# Altium schematic sheet EDVDU.SchDoc
size A0
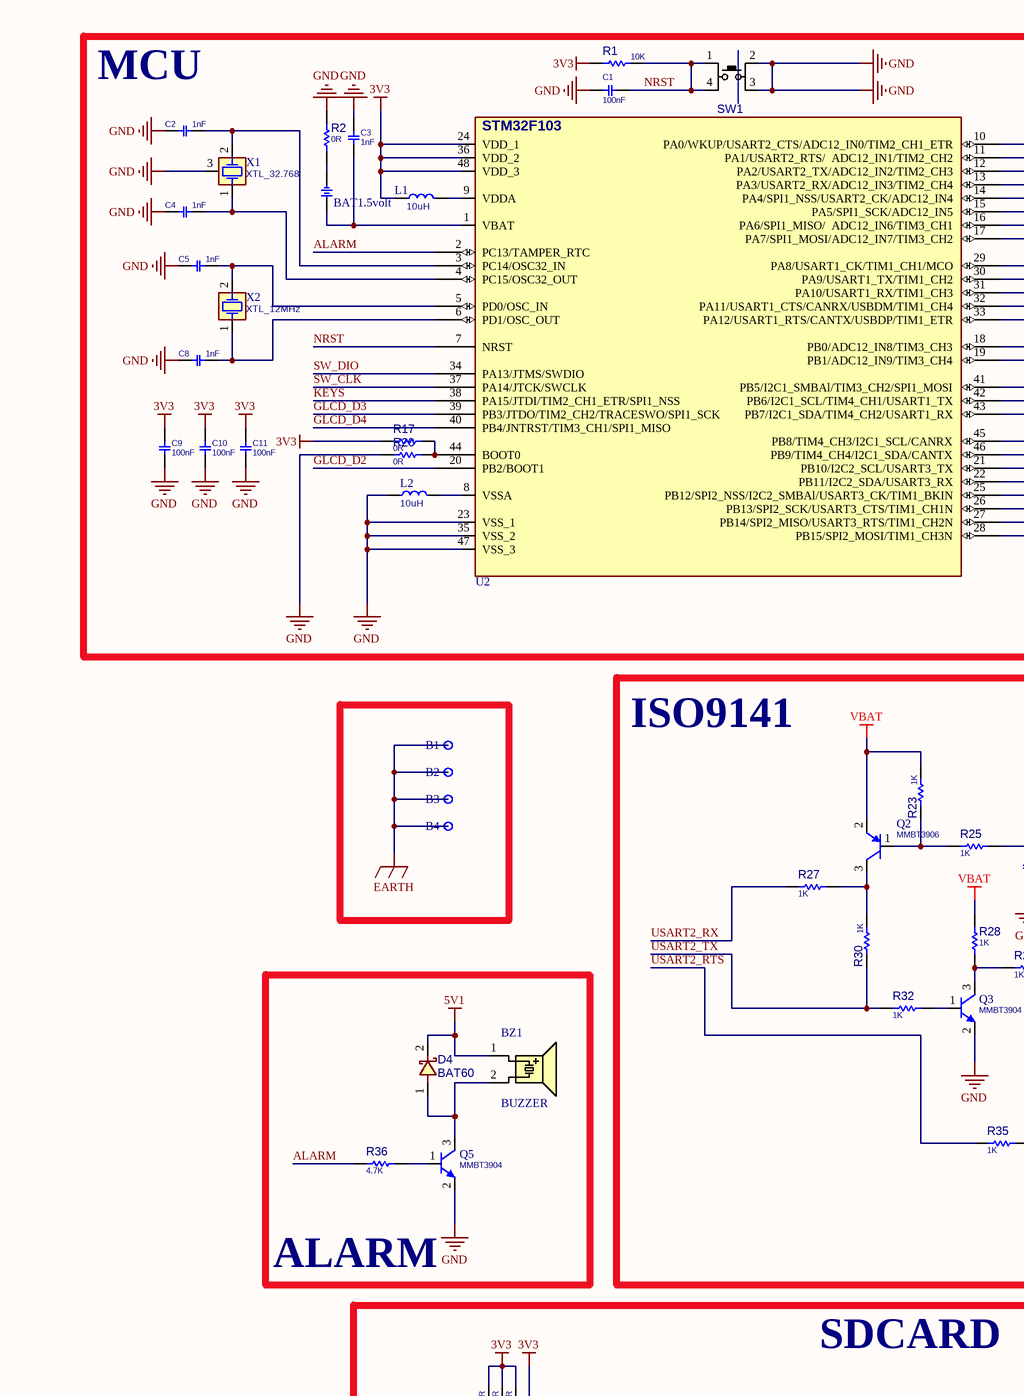
[diagram p0: EDVDU.SchDoc, top left]
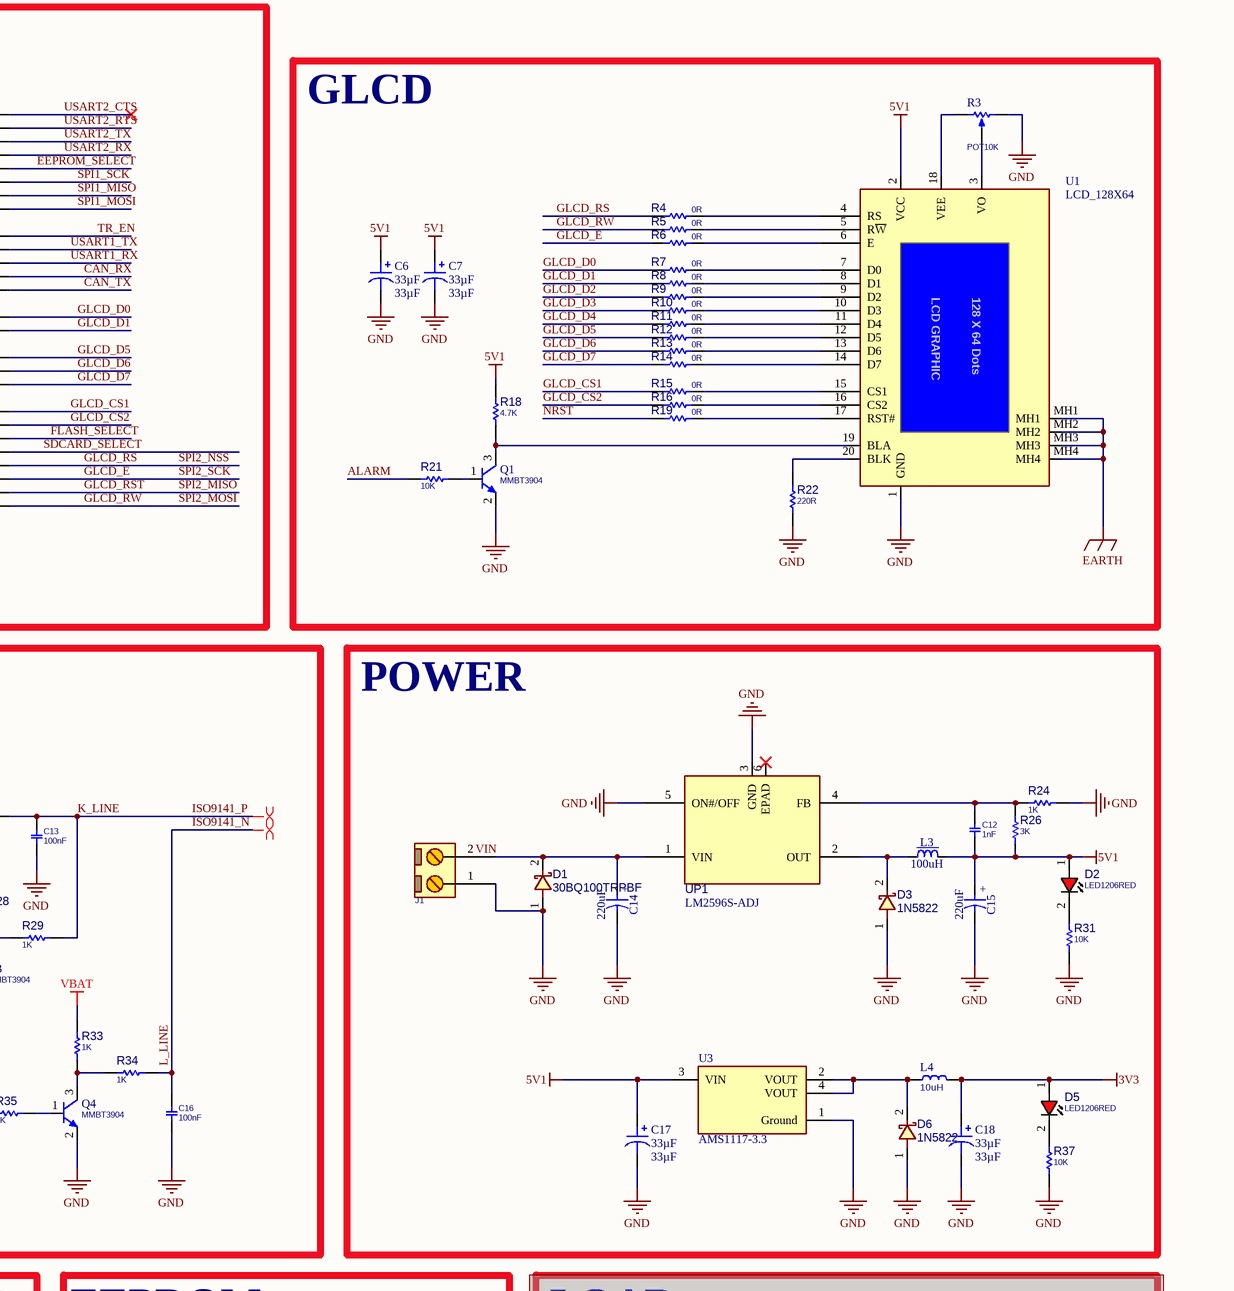
[diagram p1: EDVDU.SchDoc, top right]
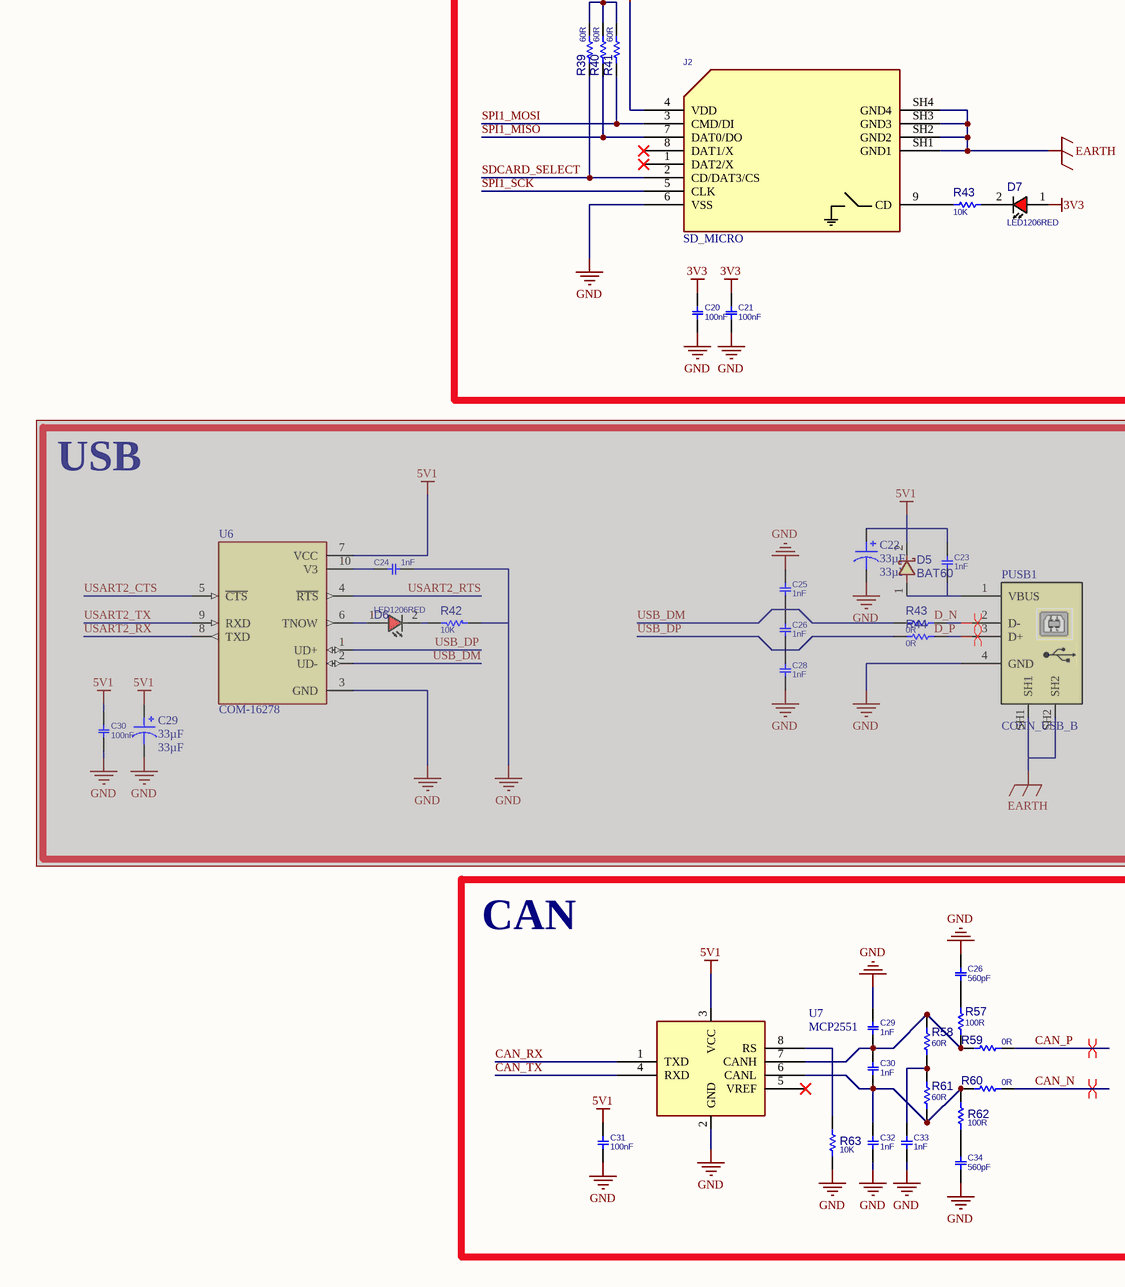
[diagram p2: EDVDU.SchDoc, bottom left]
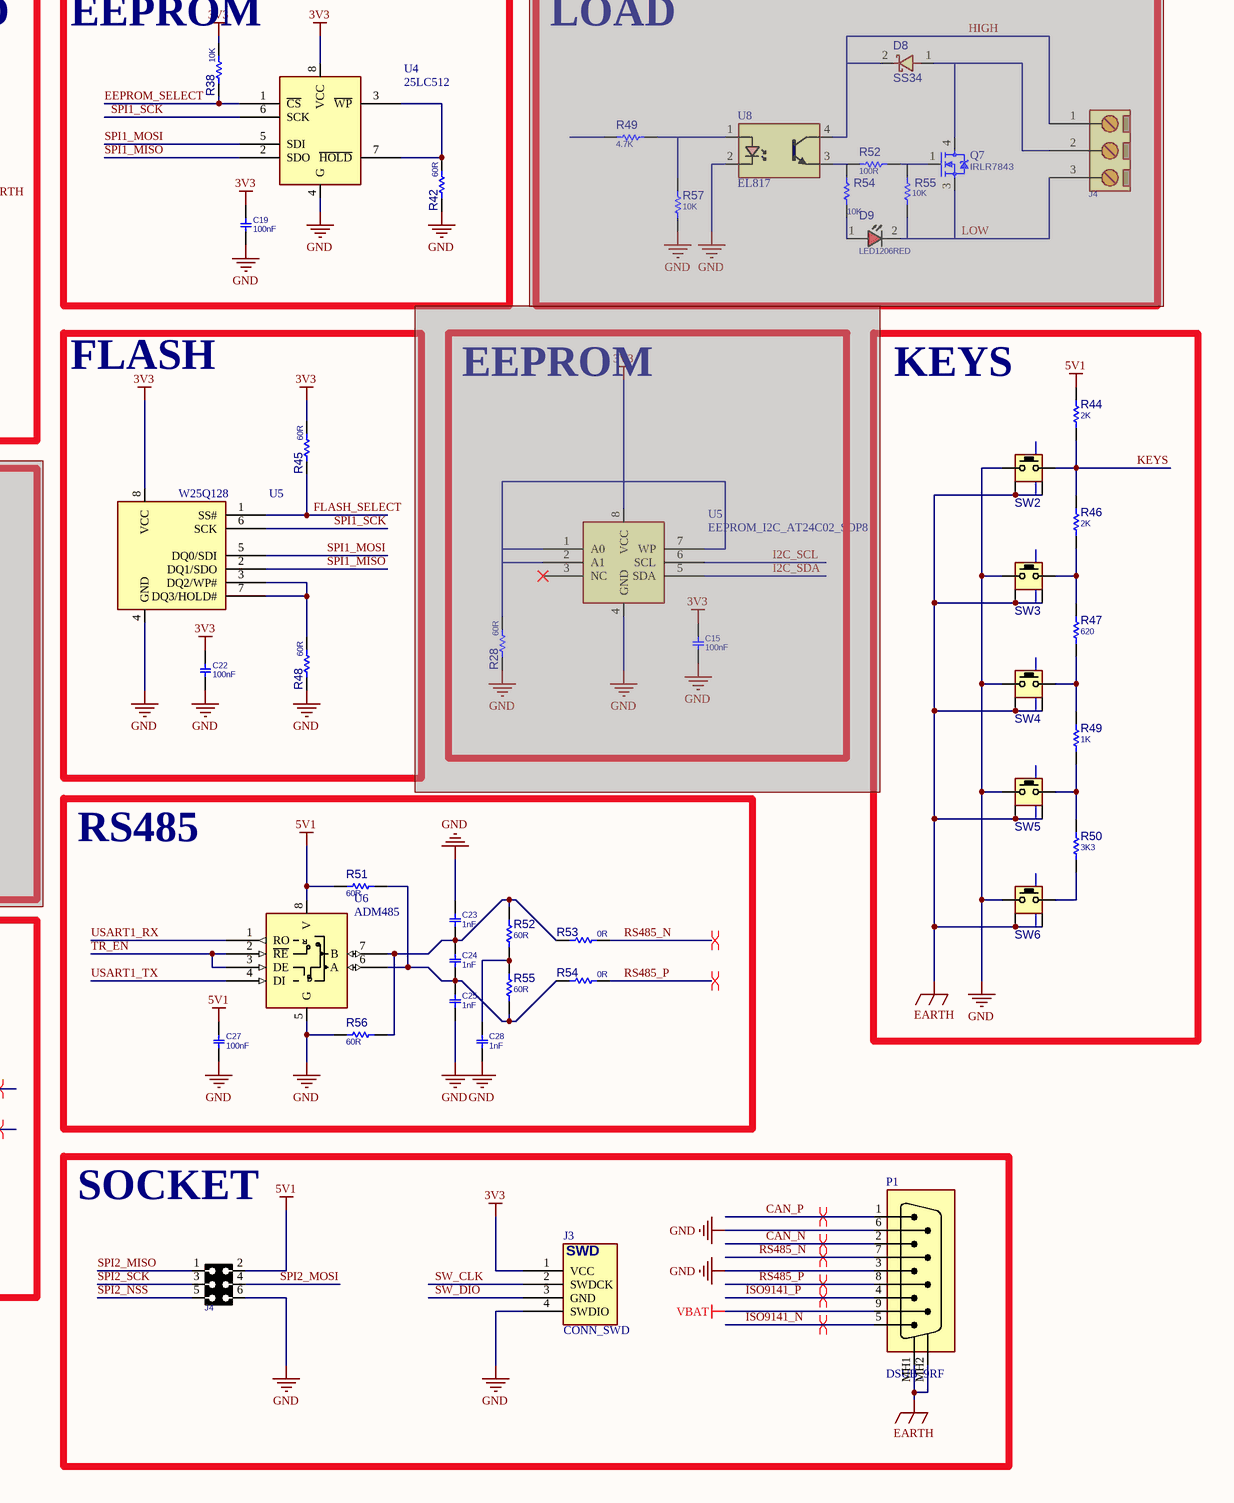
[diagram p3: EDVDU.SchDoc, bottom right]

## Parts
(Parts that share a designator on the sheet are numbered #1, #2 ... from top to bottom, then left to right.)
B1  Plated Hole  [MTG320_550]  (value not drawn)  (no BOM)
B2  Plated Hole  [MTG320_550]  (value not drawn)  (no BOM)
B3  Plated Hole  [MTG320_550]  (value not drawn)  (no BOM)
B4  Plated Hole  [MTG320_550]  (value not drawn)  (no BOM)
BT1  BAT1.5volt  [BT_TS518FE_FL35E]
BZ1  BUZZER  [BZ_C12]
C1  100nF  [C1206]
C2  1nF  [C1206]
C3  1nF  [C1206]
C4  1nF  [C1206]
C5  1nF  [C1206]
C6  33µF  [CAP POL 1206_3216]
C7  33µF  [CAP POL 1206_3216]
C8  1nF  [C1206]
C9  100nF  [C1206]
C10  100nF  [C1206]
C11  100nF  [C1206]
C12  1nF  [C1206]
C13  100nF  [C1206]
C14  220uF  [CAPMP7343X430N]
C15#1  220uF  [CAPMP7343X430N]
C15#2  100nF  [C1206]  (masked out: inside a compile mask, not in the netlist)
C16  100nF  [C1206]
C17  33µF  [CAP POL 1206_3216]
C18  33µF  [CAP POL 1206_3216]
C19  100nF  [C1206]
C20  100nF  [C1206]
C21  100nF  [C1206]
C22#1  33µF  [CAP POL 1206_3216]  (masked out: inside a compile mask, not in the netlist)
C22#2  100nF  [C1206]
C23#1  1nF  [C1206]  (masked out: inside a compile mask, not in the netlist)
C23#2  1nF  [C1206]
C24#1  1nF  [C1206]  (masked out: inside a compile mask, not in the netlist)
C24#2  1nF  [C1206]
C25#1  1nF  [C1206]  (masked out: inside a compile mask, not in the netlist)
C25#2  1nF  [C1206]
C26#1  1nF  [C1206]  (masked out: inside a compile mask, not in the netlist)
C26#2  560pF  [C1206]
C27  100nF  [C1206]
C28#1  1nF  [C1206]  (masked out: inside a compile mask, not in the netlist)
C28#2  1nF  [C1206]
C29#1  33µF  [CAP POL 1206_3216]  (masked out: inside a compile mask, not in the netlist)
C29#2  1nF  [C1206]
C30#1  100nF  [C1206]  (masked out: inside a compile mask, not in the netlist)
C30#2  1nF  [C1206]
C31  100nF  [C1206]
C32  1nF  [C1206]
C33  1nF  [C1206]
C34  560pF  [C1206]
D1  30BQ100TRPBF  [D_SMC]
D2  LED1206RED  [LED1206RED]
D3  1N5822  [D_SMA]
D4  BAT60  [D_SOD323F]
D5#1  LED1206RED  [LED1206RED]
D5#2  BAT60  [D_SOD323F]  (masked out: inside a compile mask, not in the netlist)
D6#1  1N5822  [D_SMA]
D6#2  LED1206RED  [LED1206RED]  (masked out: inside a compile mask, not in the netlist)
D7  LED1206RED  [LED1206RED]
D8  SS34  [D_SMB]  (masked out: inside a compile mask, not in the netlist)
D9  LED1206RED  [LED1206RED]  (masked out: inside a compile mask, not in the netlist)
J1  CONN_MSTB2  [MSTB_2]  (value not drawn)
J2  SD_MICRO  [SDMICRO_AT]
J3  CONN_SWD  [WF_4]
J4#1  CONN_MSTB3  [MSTB_3]  (value not drawn)  (masked out: inside a compile mask, not in the netlist)
J4#2  HDRF_2X3  [HDRR_F_2X3]  (value not drawn)
L1  10uH  [L1206]
L2  10uH  [L1206]
L3  100uH  [IND_WURTH_WE-PD_XXL]
L4  10uH  [L1206]
P1  DSUB_9RF  [DSUB_9RF]
PUSB1  CONN_USB_B  [USB_B_RA_THD]  (masked out: inside a compile mask, not in the netlist)
Q1  MMBT3904  [SOT23_3]
Q2  MMBT3906  [SOT23_3]
Q3  MMBT3904  [SOT23_3]
Q4  MMBT3904  [SOT23_3]
Q5  MMBT3904  [SOT23_3]
Q7  IRLR7843  [DPAK_3]  (masked out: inside a compile mask, not in the netlist)
R1  10K  [R0805]
R2  0R  [R0805]
R3  POT10K  [POTS_5MM]
R4  0R  [R0805]
R5  0R  [R0805]
R6  0R  [R0805]
R7  0R  [R0805]
R8  0R  [R0805]
R9  0R  [R0805]
R10  0R  [R0805]
R11  0R  [R0805]
R12  0R  [R0805]
R13  0R  [R0805]
R14  0R  [R0805]
R15  0R  [R0805]
R16  0R  [R0805]
R17  0R  [R0805]
R18  4.7K  [R0805]
R19  0R  [R0805]
R20  0R  [R0805]
R21  10K  [R0805]
R22  220R  [R0805]
R23  1K  [R0805]
R24  1K  [R1206]
R25  1K  [R0805]
R26  3K  [R1206]
R27  1K  [R0805]
R28#1  1K  [R0805]
R28#2  60R  [R0805]  (masked out: inside a compile mask, not in the netlist)
R29  1K  [R0805]
R30  1K  [R0805]
R31  10K  [R0805]
R32  1K  [R0805]
R33  1K  [R0805]
R34  1K  [R0805]
R35  1K  [R0805]
R36  4.7K  [R0805]
R37  10K  [R0805]
R38  10K  [R0805]
R39  60R  [R0805]
R40  60R  [R0805]
R41  60R  [R0805]
R42#1  60R  [R0805]
R42#2  10K  [R0805]  (masked out: inside a compile mask, not in the netlist)
R43#1  10K  [R0805]
R43#2  0R  [R0805]  (masked out: inside a compile mask, not in the netlist)
R44#1  2K  [R0805]
R44#2  0R  [R0805]  (masked out: inside a compile mask, not in the netlist)
R45  60R  [R0805]
R46  2K  [R0805]
R47  620  [R0805]
R48  60R  [R0805]
R49#1  4.7K  [R0805]  (masked out: inside a compile mask, not in the netlist)
R49#2  1K  [R0805]
R50  3K3  [R0805]
R51  60R  [R0805]
R52#1  100R  [R0805]  (masked out: inside a compile mask, not in the netlist)
R52#2  60R  [R0805]
R53  0R  [R0805]
R54#1  10K  [R0805]  (masked out: inside a compile mask, not in the netlist)
R54#2  0R  [R0805]
R55#1  10K  [R0805]  (masked out: inside a compile mask, not in the netlist)
R55#2  60R  [R0805]
R56  60R  [R0805]
R57#1  10K  [R0805]  (masked out: inside a compile mask, not in the netlist)
R57#2  100R  [R0805]
R58  60R  [R0805]
R59  0R  [R0805]
R60  0R  [R0805]
R61  60R  [R0805]
R62  100R  [R0805]
R63  10K  [R0805]
SW1  PUSHBUTTON  [SWPBS_SPDT_6X6X5]  (value not drawn)
SW2  PUSHBUTTON  [SWPBT_SPST_R_6X6X6]  (value not drawn)
SW3  PUSHBUTTON  [SWPBT_SPST_R_6X6X6]  (value not drawn)
SW4  PUSHBUTTON  [SWPBT_SPST_R_6X6X6]  (value not drawn)
SW5  PUSHBUTTON  [SWPBT_SPST_R_6X6X6]  (value not drawn)
SW6  PUSHBUTTON  [SWPBT_SPST_R_6X6X6]  (value not drawn)
U1  LCD_128X64  [LCDG_128X64_BLU]
U2  STM32F103  [QFG50_48]  (value not drawn)
U3  AMS1117-3.3  [FP-AMS1117-IPC_B]
U4  25LC512  [SO_8]
U5#1  W25Q128  [SO_8_W]
U5#2  EEPROM_I2C_AT24C02_SOP8  [SO_8]  (masked out: inside a compile mask, not in the netlist)
U6#1  COM-16278  [SOP50P490X120-10N]  (masked out: inside a compile mask, not in the netlist)
U6#2  ADM485  [SO_8]
U7  MCP2551  [SO_8]
U8  EL817  [DIP_4SMD]  (masked out: inside a compile mask, not in the netlist)
UP1  LM2596S-ADJ  [D2PAK_5]
X1  XTL_32.768  [XTL_RTC]
X2  XTL_12MHz  [XTL_2_11X5]

## Blocks framed on the sheet
MCU: BT1 C1-C5 C8-C11 L1 L2 R1 R2 R17 R20 SW1 U2 X1 X2
GLCD: C6 C7 Q1 R3-R16 R18 R19 R21 R22 U1
ISO9141: C13 C16 Q2-Q4 R23 R25 R27 R28#1 R29 R30 R32-R35
POWER: C12 C14 C15#1 C17 C18 D1-D3 D5#1 D6#1 J1 L3 L4 R24 R26 R31 R37 U3 UP1
ALARM: BZ1 D4 Q5 R36
SDCARD: C20 C21 D7 J2 R39-R41 R43#1
EEPROM: C19 R38 R42#1 U4
LOAD: D8 D9 J4#1 Q7 R49#1 R52#1 R54#1 R55#1 R57#1 U8
FLASH: C22#2 R45 R48 U5#1
EEPROM: C15#2 R28#2 U5#2
KEYS: R44#1 R46 R47 R49#2 R50 SW2-SW6
USB: C22#1 C23#1 C24#1 C25#1 C26#1 C28#1 C29#1 C30#1 D5#2 D6#2 PUSB1 R42#2 R43#2 R44#2 U6#1
RS485: C23#2 C24#2 C25#2 C27 C28#2 R51 R52#2 R53 R54#2 R55#2 R56 U6#2
CAN: C26#2 C29#2 C30#2 C31-C34 R57#2 R58-R63 U7
SOCKET: J3 J4#2 P1

## Nets
3V3: C9.2 C10.2 C11.2 C18.1 C19.2 C20.2 C21.2 C22#2.2 D5#1.1(ANODE) D7.1(ANODE) J2.4(VDD) J3.1(VCC) L1.1 L4.2 R1.2 R17.2 R38.1 R39.1 R40.1 R41.1 R45.1 U2.24(VDD_1) U2.36(VDD_2) U2.48(VDD_3) U4.8(VCC) U5#1.8(VCC)
5V1: BZ1.1(A) C6.1 C7.1 C12.1 C15#1.1 C17.1 C27.2 C31.2 D2.1(ANODE) D4.2 J4#2.2 L3.2 R18.1 R26.1 R44#1.2 R51.2 U1.2(VCC) U3.3(VIN) U6#2.8(V) U7.3(VCC)
EARTH: B1.1 B2.1 B3.1 B4.1 J2.SH1(GND1) J2.SH2(GND2) J2.SH3(GND3) J2.SH4(GND4) P1.MH1 P1.MH2 SW2.MH1 SW2.MH2 SW3.MH1 SW3.MH2 SW4.MH1 SW4.MH2 SW5.MH1 SW5.MH2 SW6.MH1 SW6.MH2 U1.MH1 U1.MH2 U1.MH3 U1.MH4
GND: C1.1 C2.2 C3.2 C4.2 C5.2 C6.2 C7.2 C8.2 C9.1 C10.1 C11.1 C13.1 C14.2 C15#1.2 C16.1 C17.2 C18.2 C19.1 C20.1 C21.1 C22#2.1 C23#2.1 C25#2.2 C26#2.2 C27.1 C28#2.2 C29#2.1 C31.1 C32.2 C33.2 C34.2 D1.1 D3.1 D6#1.1 J1.1 J2.6(VSS) J3.4(SWDIO) J4#2.6 L2.1 P1.3 P1.6 Q1.2(E) Q3.2(E) Q4.2(E) Q5.2(E) R2.2 R3.3(BOT) R20.2 R22.1 R24.1 R31.1 R37.1 R42#1.2 R48.2 R56.2 R63.1 SW1.2(P3) SW1.3(P4) SW2.1 SW3.1 SW4.1 SW5.1 SW6.1 U1.1(GND) U2.23(VSS_1) U2.35(VSS_2) U2.47(VSS_3) U3.1(Ground) U4.4(G) U5#1.4(GND) U6#2.5(G) U7.2(GND) UP1.3(GND) UP1.5(ON#/OFF) X1.3(CASE)
VBAT: P1.9 Q2.2(E) R23.1 R28#1.1 R33.1
ALARM: R21.1 R36.2 U2.2(PC13/TAMPER_RTC)
CAN_N: P1.2 R60.2
CAN_P: P1.1 R59.2
CAN_RX: U2.32(PA11/USART1_CTS/CANRX/USBDM/TIM1_CH4) U7.1(TXD)
CAN_TX: U2.33(PA12/USART1_RTS/CANTX/USBDP/TIM1_ETR) U7.4(RXD)
EEPROM_SELECT: R38.2 U2.14(PA4/SPI1_NSS/USART2_CK/ADC12_IN4) U4.1(~{CS})
FLASH_SELECT: R45.2 U2.21(PB10/I2C2_SCL/USART3_TX) U5#1.1(SS#)
GLCD_CS1: R15.1 U2.45(PB8/TIM4_CH3/I2C1_SCL/CANRX)
GLCD_CS2: R16.1 U2.46(PB9/TIM4_CH4/I2C1_SDA/CANTX)
GLCD_D0: R7.1 U2.18(PB0/ADC12_IN8/TIM3_CH3)
GLCD_D1: R8.1 U2.19(PB1/ADC12_IN9/TIM3_CH4)
GLCD_D2: R9.1 U2.20(PB2/BOOT1)
GLCD_D3: R10.1 U2.39(PB3/JTDO/TIM2_CH2/TRACESWO/SPI1_SCK)
GLCD_D4: R11.1 U2.40(PB4/JNTRST/TIM3_CH1/SPI1_MISO)
GLCD_D5: R12.1 U2.41(PB5/I2C1_SMBAl/TIM3_CH2/SPI1_MOSI)
GLCD_D6: R13.1 U2.42(PB6/I2C1_SCL/TIM4_CH1/USART1_TX)
GLCD_D7: R14.1 U2.43(PB7/I2C1_SDA/TIM4_CH2/USART1_RX)
GLCD_E: J4#2.3 R6.1 U2.26(PB13/SPI2_SCK/USART3_CTS/TIM1_CH1N)  [also labelled SPI2_SCK]
GLCD_RS: J4#2.5 R4.1 U2.25(PB12/SPI2_NSS/I2C2_SMBAl/USART3_CK/TIM1_BKIN)  [also labelled SPI2_NSS]
GLCD_RST: J4#2.1 U2.27(PB14/SPI2_MISO/USART3_RTS/TIM1_CH2N)  [also labelled SPI2_MISO]
GLCD_RW: J4#2.4 R5.1 U2.28(PB15/SPI2_MOSI/TIM1_CH3N)  [also labelled SPI2_MOSI]
ISO9141_N: C16.2 P1.5 R34.1  [also labelled L_LINE]
ISO9141_P: C13.2 P1.4 R25.1 R29.1  [also labelled K_LINE]
KEYS: R44#1.1 R46.2 SW2.2 U2.38(PA15/JTDI/TIM2_CH1_ETR/SPI1_NSS)
NRST: C1.2 R1.1 R19.1 SW1.1(P1) SW1.4(P2) U2.7(NRST)
RS485_N: P1.7 R53.2
RS485_P: P1.8 R54#2.2
SDCARD_SELECT: J2.2(CD/DAT3/CS) R39.2 U2.22(PB11/I2C2_SDA/USART3_RX)
SPI1_MISO: J2.7(DAT0/DO) R40.2 U2.16(PA6/SPI1_MISO/__ADC12_IN6/TIM3_CH1) U4.2(SDO) U5#1.2(DQ1/SDO)
SPI1_MOSI: J2.3(CMD/DI) R41.2 U2.17(PA7/SPI1_MOSI/ADC12_IN7/TIM3_CH2) U4.5(SDI) U5#1.5(DQ0/SDI)
SPI1_SCK: J2.5(CLK) U2.15(PA5/SPI1_SCK/ADC12_IN5) U4.6(SCK) U5#1.6(SCK)
SW_CLK: J3.2(SWDCK) U2.37(PA14/JTCK/SWCLK)
SW_DIO: J3.3(GND) U2.34(PA13/JTMS/SWDIO)
TR_EN: U2.29(PA8/USART1_CK/TIM1_CH1/MCO) U6#2.2(~{RE}) U6#2.3(DE)
USART1_RX: U2.31(PA10/USART1_RX/TIM1_CH3) U6#2.1(RO)
USART1_TX: U2.30(PA9/USART1_TX/TIM1_CH2) U6#2.4(DI)
USART2_CTS: U2.10(PA0/WKUP/USART2_CTS/ADC12_IN0/TIM2_CH1_ETR)
USART2_RTS: R35.2 U2.11(PA1/USART2_RTS/__ADC12_IN1/TIM2_CH2)
USART2_RX: R27.2 U2.13(PA3/USART2_RX/ADC12_IN3/TIM2_CH4)
USART2_TX: R30.2 R32.2 U2.12(PA2/USART2_TX/ADC12_IN2/TIM2_CH3)
NetBT1_1: BT1.1 C3.1 U2.1(VBAT)
NetBT1_2: BT1.2 R2.1
NetBZ1_2: BZ1.2(B) D4.1 Q5.3(C)
NetC2_1: C2.1 U2.3(PC14/OSC32_IN) X1.2(OSC2)
NetC4_1: C4.1 U2.4(PC15/OSC32_OUT) X1.1(OSC1)
NetC5_1: C5.1 U2.5(PD0/OSC_IN) X2.2(OSC2)
NetC8_1: C8.1 U2.6(PD1/OSC_OUT) X2.1(OSC1)
NetC12_2: C12.2 R24.2 R26.2 UP1.4(FB)
NetC14_1: C14.1 D1.2 J1.2 UP1.1(VIN)
NetC23#2_2: C23#2.2 C24#2.1 R52#2.2 R53.1 R56.1 U6#2.7(B)
NetC24#2_2: C24#2.2 C25#2.1 R51.1 R54#2.1 R55#2.1 U6#2.6(A)
NetC26#2_1: C26#2.1 R57#2.1
NetC28#2_1: C28#2.1 R52#2.1 R55#2.2
NetC29#2_2: C29#2.2 C30#2.1 R57#2.2 R58.2 R59.1 U7.7(CANH)
NetC30#2_2: C30#2.2 C32.1 R60.1 R61.1 R62.2 U7.6(CANL)
NetC33_1: C33.1 R58.1 R61.2
NetC34_1: C34.1 R62.1
NetD2_2: D2.2(CATHODE) R31.2
NetD3_2: D3.2 L3.1 UP1.2(OUT)
NetD5#1_2: D5#1.2(CATHODE) R37.2
NetD6#1_2: D6#1.2 L4.1 U3.2(VOUT) U3.4(VOUT)
NetD7_2: D7.2(CATHODE) R43#1.2
NetJ2_9: J2.9(CD) R43#1.1
NetL1_2: L1.2 U2.9(VDDA)
NetL2_2: L2.2 U2.8(VSSA)
NetQ1_1: Q1.1(B) R21.2
NetQ1_3: Q1.3(C) R18.2 U1.19(BLA)
NetQ2_1: Q2.1(B) R23.2 R25.2
NetQ2_3: Q2.3(C) R27.1 R30.1
NetQ3_1: Q3.1(B) R32.1
NetQ3_3: Q3.3(C) R28#1.2 R29.2
NetQ4_1: Q4.1(B) R35.1
NetQ4_3: Q4.3(C) R33.2 R34.2
NetQ5_1: Q5.1(B) R36.1
NetR3_1: R3.1(TOP) U1.18(VEE)
NetR3_2: R3.2(TAP) U1.3(VO)
NetR4_2: R4.2 U1.4(RS)
NetR5_2: R5.2 U1.5(R~{W})
NetR6_2: R6.2 U1.6(E)
NetR7_2: R7.2 U1.7(D0)
NetR8_2: R8.2 U1.8(D1)
NetR9_2: R9.2 U1.9(D2)
NetR10_2: R10.2 U1.10(D3)
NetR11_2: R11.2 U1.11(D4)
NetR12_2: R12.2 U1.12(D5)
NetR13_2: R13.2 U1.13(D6)
NetR14_2: R14.2 U1.14(D7)
NetR15_2: R15.2 U1.15(CS1)
NetR16_2: R16.2 U1.16(CS2)
NetR17_1: R17.1 R20.1 U2.44(BOOT0)
NetR19_2: R19.2 U1.17(RST#)
NetR22_2: R22.2 U1.20(BLK)
NetR42#1_1: R42#1.1 U4.3(~{WP}) U4.7(~{HOLD})
NetR46_1: R46.1 R47.2 SW3.2
NetR47_1: R47.1 R49#2.2 SW4.2
NetR48_1: R48.1 U5#1.3(DQ2/WP#) U5#1.7(DQ3/HOLD#)
NetR49#2_1: R49#2.1 R50.2 SW5.2
NetR50_1: R50.1 SW6.2
NetR63_2: R63.2 U7.8(RS)

Not connected (* = marked no-connect by the designer): J2 1(DAT2/X)* 8(DAT1/X)*; U7 5(VREF)*; UP1 6(EPAD)*

## Layout directives
differential pair: (no net found under the mark), CAN_N, CAN_P, ISO9141_N, ISO9141_P, RS485_N, RS485_P

## Notes on the sheet
- Labels drawn without touching a wire or pin: VIN
- (in symbol ADM485_SOP8) R; D
- (in symbol CONN_SWD) SWD
- (in symbol CTE7343-43_47UF_35V_10%) +
- (in symbol LCDG_128X64_BLU) LCD GRAPHIC; 128 X 64 Dots

## Library data of the parts
B1-B4 = PLATED_HOLE3.2_PAD5.5: Single Terminal Socket; Part Description: Plated Through Hole: Hole Dia.=3.2mm Pad Dia.=5.5mm; Mounted: No; Part Number: PLATED_HOLE3.2_PAD5.5; Component Type: Standard (No BOM); Pin Count: 1; Family: Plated Hole; Socket: No; SMD: No; Sense: No; Status: None; ComponentHeight: 0mm; HelpURL: Undefined; Author: CERN DEM JMW; CreateDate: 10/1/2012; LatestRevisionDate: 10/1/2012; PackageDescription: Plated Through Hole: Hole Dia.=3.2mm Pad Dia.=5.5mm
BT1 = BATT_MS518SE: BATTERY HOLDER, MS518SE TS518FE; MANF_P#: MS518SE-FL35E; MANF_P#2: TS518FE-FL35E; MANF: SEIKO; VALUE: BAT1.5volt
BZ1 = BUZZER_C12: Buzzer, 12X8.5mm, Magnetic Transducer; MANF: Buerklin, CUI; MANF_P#: CM12P, MT03-H1BHP, BMT1205XH7.5, CEM-1201(50); PARAM: 2048 ±200 Hz; PRICE: PRICE; VALUE: BUZZER
C1-C5 C8-C13 C15#2 C16 C19-C21 C22#2 C23#1 C23#2 C24#1 C24#2 C25#1 C25#2 C26#1 C26#2 C27 C28#1 C28#2 C29#2 C30#1 C30#2 C31-C34 = CAP_SMD_MLCC: CAP, SMD, MLCC; PARAM: 50V; DESC: CAP, MLCC, 1nF, 50V, C0G, 10%, 0402; MANF_P#: MANF_PART#; MANF: Murata; PARAM2: C0G, 10%; PRICE: 100= 1$; ASSEMBLY: ASSEMBLY
  C1 C9-C11 C13 C15#2 C16 C19-C21 C22#2 C27 C30#1 C31: VALUE: 100nF
  C2-C5 C8 C12 C23#1 C23#2 C24#1 C24#2 C25#1 C25#2 C26#1 C28#1 C28#2 C29#2 C30#2 C32 C33: VALUE: 1nF
  C26#2 C34: VALUE: 560pF
C6 C7 C17 C18 C22#1 C29#1 = T527I336M010ATE200: CAP TANT POLY 33UF 10V 1206; Part Number: T527I336M010ATE200; Value: 33µF
C14 C15#1 = CTE7343-43_47UF_35V_10%: Polarised capacitor; Part Description: Solid Tantalum Chip Capacitor; Manufacturer: GENERIC; Manufacturer1 Part Number: TAJE476K035R; Value: 47uF; Voltage: 35V; Tolerance: ±10%; Part Number: CTE7343-43_47UF_35V_10%; Component Kind: Standard; Component Type: Standard; Pin Count: 2; Status: Preferred; Manufacturer Part Number: CTE7343-43_47UF_35V_10%; Case: E; Mounted: Yes; Socket: No; SMD: Yes; Sense: No; Manufacturer1 Example: AVX; Manufacturer1 ComponentHeight: 4.3mm; HelpURL: \\cern.ch\dfs\Applications\Altium\Datasheets\CTE_AVX_TAJ.pdf; Author: CERN DEM JLC; CreateDate: 12/3/2007; LatestRevisionDate: 12/3/2007
D1 = DIODE_SMD_SCHOTTKY_30BQ100TRPBF: DIODE, SCHOTTKY, 100V, 3A; MANF: Vishay; DESC: DESCRIPTION; MANF_P#: 30BQ100TRPBF; ASSEMBLY: ASSEMBLY; PRICE: PRICE; PARAM2: 3A; PARAM: 100V; VALUE: 30BQ100TRPBF
D2 D5#1 D6#2 D7 D9 = LED_SMD_1206_RED: LED, SMD, 1206, RED; DESC: DESCRIPTION; MANF_P#: MANF_PART#; PARAM2: 2.2V; MANF: MANF; ASSEMBLY: ASSEMBLY; PRICE: 36t@Javan; VALUE: LED1206RED
D3 D6#1 = DIODE_SMD_SCHOTTKY_1N5822: DIODE, SCHOTTKY, 40V, 3A; MANF: DIODES; DESC: DESCRIPTION; MANF_P#: 1N5822; ASSEMBLY: ASSEMBLY; PRICE: PRICE; PARAM2: 3A; PARAM: 40V; VALUE: 1N5822
D4 D5#2 = DIODE_SMD_SCHOTTKY_BAT60: DIODE, SCHOTTKY, 10V, 3A, 0.3Vf; MANF: Infineon; MANF_P#: BAT60AE6327HTSA1; DESC: DESCRIPTION; PARAM2: VFdrop: 0.1V@10mA, 0.22V@1A; PARAM: 3A, 1.35W, -55~85oC; ASSEMBLY: ASSEMBLY; PRICE: 0.4$; VALUE: BAT60
D8 = DIODE_SMD_SCHOTTKY_SS34: DIODE, SCHOTTKY, 20V, 3A; MANF: VISHAY; DESC: DESCRIPTION; MANF_P#: SS34; ASSEMBLY: ASSEMBLY; PRICE: PRICE; PARAM2: 3A; PARAM: 20V; VALUE: SS34
J1 = CONN_MSTB_2: CONN, PHOENIX MSTB 2.5/2-GF-5.08; VALUE: CONN_MSTB2; MANF_P#: MSTB 2.5/2-GF-5.08
J2 = SOCKET_SDMICRO_AT: SD MICRO exist in Iran, Attend 112J-TDAR-R01; PARAM: push-push; MANF: Attend; MANF_P#: 112J-TDAR-R01; VALUE: SD_MICRO
J3 = CONN_SWD: CONN, SWD, ST; VALUE: CONN_SWD
J4#1 = CONN_MSTB_3: CONN, PHOENIX MSTB 2.5/3-GF-5.08; VALUE: CONN_MSTB3; MANF_P#: MSTB 2.5/3-GF-5.08
J4#2 = HDRR_F_2X3: CONN, HEADER, RightAngle, Female, pitch: 2.54mm, 6POS; MANF_P#: MANF_PART#; MANF: MANF; VALUE: HDRF_2X3
L1 L2 L4 = IND_SMD: IND, SMD; VALUE: 10uH
L3 = IND_100UH_20%_WURTH_WE-PD_7447709101: Inductor With Core; Part Description: Power-Choke Inductor (WE-PD Series); Manufacturer: WURTH ELEKTRONIK; Power: 2.5A; Resistance: 0.1R; Tolerance: ±20%; Part Number: IND_100UH_20%_WURTH_WE-PD_7447709101; Component Kind: Standard; Component Type: Standard; Pin Count: 2; Value: 100uH; Status: None; Manufacturer Part Number: 7447709101; Mounted: Yes; Socket: No; SMD: Yes; Sense: No; ComponentHeight: 10mm; HelpURL: \\cern.ch\dfs\Applications\Altium\Datasheets\IND_WURTH_WE-PD_7447709101.pdf; Author: CERN DEM JLC; CreateDate: 3/15/2012; LatestRevisionDate: 3/15/2012
P1 = CONN_DSUB_9RF: CONN, DSUB, HD, 9PIN, R/A, FEMALE, THD; MANF_P#: -; MANF: -; VALUE: DSUB_9RF
PUSB1 = CONN_USB_B_RA_THD: CONN, USB, B, R/A, THD; MANF_P#: 292304-1; MANF: TE Connectivity; VALUE: CONN_USB_B
Q1 Q3-Q5 = NPN_MMBT3904_SOT23: BJT, NPN, 40v, 0.2A, SMD, SOT23; PARAM2: 250mW; MANF: Diodes, NXP, FAIRCHILD, ON; PARAM: 40v, 0.2A; MANF_P#: MMBT3904; VALUE: MMBT3904
Q2 = PNP_MMBT3906_SOT23: BJT, PNP, 40v, 0.2A, SMD, SOT23; PARAM2: 250mW; MANF: Diodes, NXP, FAIRCHILD, ON; PARAM: 40v, 0.2A; MANF_P#: MMBT3906; VALUE: MMBT3906
Q7 = MOSN_IRLR7843_DPAK: HEXFET Power MOSFET; ASSEMBLY: ASSEMBLY; MANF_P#: IRLR7843; VALUE: IRLR7843
R1 R2 R4-R27 R28#1 R28#2 R29-R41 R42#1 R42#2 R43#1 R43#2 R44#1 R44#2 R45-R48 R49#1 R49#2 R50 R51 R52#1 R52#2 R53 R54#1 R54#2 R55#1 R55#2 R56 R57#1 R57#2 R58-R63 = RES_SMD: RES, SMD; MANF_P#: RK73H1ETTP4701F; MANF: KOA SPEER; PARAM: 0.063W; DESC: DESCRIPTION; DIST#: MOUSER; PARAM2: 1%; ASSEMBLY: ASSEMBLY; PRICE: 100= 0.5$
  R1 R21 R31 R37 R38 R42#2 R43#1 R54#1 R55#1 R57#1 R63: VALUE: 10K
  R2 R4-R17 R19 R20 R43#2 R44#2 R53 R54#2 R59 R60: VALUE: 0R
  R18 R36 R49#1: VALUE: 4.7K
  R22: VALUE: 220R
  R23-R25 R27 R28#1 R29 R30 R32-R35 R49#2: VALUE: 1K
  R26: VALUE: 3K
  R28#2 R39-R41 R42#1 R45 R48 R51 R52#2 R55#2 R56 R58 R61: VALUE: 60R
  R44#1 R46: VALUE: 2K
  R47: VALUE: 620
  R50: VALUE: 3K3
  R52#1 R57#2 R62: VALUE: 100R
R3 = RES_SMD_POT_5MM: RESISTOR, SMD, Potentiometer, 5mm; VALUE: POT10K
SW1 = SWPBS_SPDT_6X6X5_TL3301: SWITCH, PUSH BUTTON, TACTILE, SMD, SPDT, 6X6X5mm; MANF: ESWITCH; DESC: DESCRIPTION; MANF_P#: TL3301EF100QG; VALUE: PUSHBUTTON; ASSEMBLY: ASSEMBLY; PARAM: PARAM; PRICE: PRICE
SW2-SW6 = SWPBT_SPST_R_6X6X6_SKHHLUA010: SWITCH, PUSH BUTTON, TACTILE, THD, SPST, 6X6X6mm RIGHT; MANF: ALPS; DESC: DESCRIPTION; VALUE: PUSHBUTTON; ASSEMBLY: ASSEMBLY; PARAM: PARAM; PRICE: PRICE; MANF_P#: SKHHLUA010
U1 = LCDG_128X64_BLU: LCD Graphic Disp, 128X64, with KS108 Controller; MANF_P#: TS12864A-2, LCD12864A, GDM12864A; PARAM2: Green back, Gray, 5V; PARAM: 128X64 Dots, 2.9"; MANF: -; VALUE: LCD_128X64
U2 = STM32F103C8T6_QFP48: MCU, STM32 ARM 32-bit, Cortex M3, 64KB FLASH, 20KB SRAM; DESC: CAN, I2C, SPI, USART, USB; MANF: ST; PARAM2: 2~3.6VCC, 72MHz, 2X12Bit ADC; PARAM: 64KB FLASH, 20KB SRAM, -40~85oC; MANF_P#: STM32F103C8T6; PRICE: 6$; VALUE: STM32F103
U3 = CMP-209535-000001-1: LDO Voltage Regulators 1A, 3.3V; Manufacturer: Advanced Monolithic Systems; Dropout Voltage: 1.1V; Output Type: Fixed; Nominal Supply Current: 5mA; Max Power Dissipation: 1.2W; Max Supply Voltage: 15V; Number Of Outputs: 1; Standoff Height: 0.64mm; Max Junction Temp: +125°C; Height: 1.8mm; Package: AMS1117; Device Class L2: Power Management ICs; ComponentLink2Description: Datasheet; ComponentLink2URL: http://www.advanced-monolithic.com/pdf/ds1117.pdf; Category: IC; RoHS: TRUE; Automotive: No; Device Class L1: Integrated Circuits (ICs); Output Current: 1A; Device Class L3: Voltage Regulators - Linear; Temperature: -40°C to +125°C; Output Voltage: 3.3V; Manufacturer Part Number: AMS1117-3.3; Temperature Range Low: -40°C; Octopart: https://octopart.com/ams1117-3.3-advanced+monolithic+systems-25899300; Lead Free: Yes; Ipc Land Pattern Name: SOT229P700X180-4; Temperature Range High: +125°C
U4 = EEPROM_SPI_25LC512_SOP8: EEPROM, SPI, 512kbit (64K x8), SOP-8; MANF: Microchip; MANF_P#: 25LC512-E/SN; PARAM2: 2.5~5.5V, 200Year, 20MHz; PARAM: 512kbit (64K x8), -40~125oC; PRICE: 2$; VALUE: 25LC512
U5#1 = W25Q128_SO8W: SPI FLASH Memory, 128Mb (16M x8), 104MHz; MANF: WINBOND; MANF_P#: W25Q128FVSIG; PARAM2: 2.7~3.6V; PARAM: 128Mb (16M x8), 104MHz; PRICE: 1.6$; VALUE: W25Q128
U5#2 = EEPROM_I2C_AT24C02_SOP8: EEPROM, I2C; VALUE: AT24C02
U6#1 = COM-16278: SparkFun Accessories USB to Serial IC - CH340E (10 Pack); MP: COM-16278; Purchase-URL: https://pricing.snapeda.com/search/part/COM-16278/?ref=eda; Price: None; SnapEDA_Link: https://www.snapeda.com/parts/COM-16278/SparkFun/view-part/?ref=snap; Check_prices: https://www.snapeda.com/parts/COM-16278/SparkFun/view-part/?ref=eda; Package: None; MF: SparkFun; Availability: In Stock; Value: *
U6#2 = ADM485_SOP8: RS485 Transceiver, 5V, SOP-8, ±7V Ground Difference Between Devices on the Bus; MANF_P#: ADM485AR; MANF: Analog Devices; PRICE: 4000toman@PAYA; VALUE: ADM485
U7 = MCP2551_SOP8: Can, Transceiver, High Speed, 5V (VDD); MANF: MICROCHIP; MANF_P#: MCP2551-I/SN; PARAM2: 5V (VDD), 12/24V; PRICE: 3000toman@PAYA; PARAM: PARAM; VALUE: MCP2551
U8 = OPTC_TR4P_EL817_SMD: OPTOCOUPLER, TRANSISTOR, 4PIN; PARAM: IF=5mA; PARAM2: VCE = 5V; PRICE: 300t@Paya; VALUE: EL817
UP1 = VREG_LM2596S-ADJ: REG, Switching, Buck, 3A, ADJ, 150KHz, TO-263; MANF: TI, ON, TS; PARAM: 3A, ADJ; PARAM2: 50KHz, 40VIN; ASSEMBLY: ASSEMBLY; PRICE: PRICE; DESC: REG, Switching, Buck, 3A, ADJ, 150KHz, TO-263; MANF_P#: LM2596S-ADJ; VALUE: LM2596S-ADJ
X1 = XTL_3_32.768_SMD: Crystal MOST POPULAR PACKAGE; MANF: ABRACON; MANF_P#: AB26T-32.768KHZ; PARAM2: 12pF; PARAM: 20PPM, -40~85°C; VALUE: XTL_32.768
X2 = XTL_2_HC49_SMD: Crystal MOST POPULAR ABL HC49 PACKAGE; VALUE: XTL_12MHz